# EAGLE board Okapi (EAGLE 9.6.2), part 1 of 2
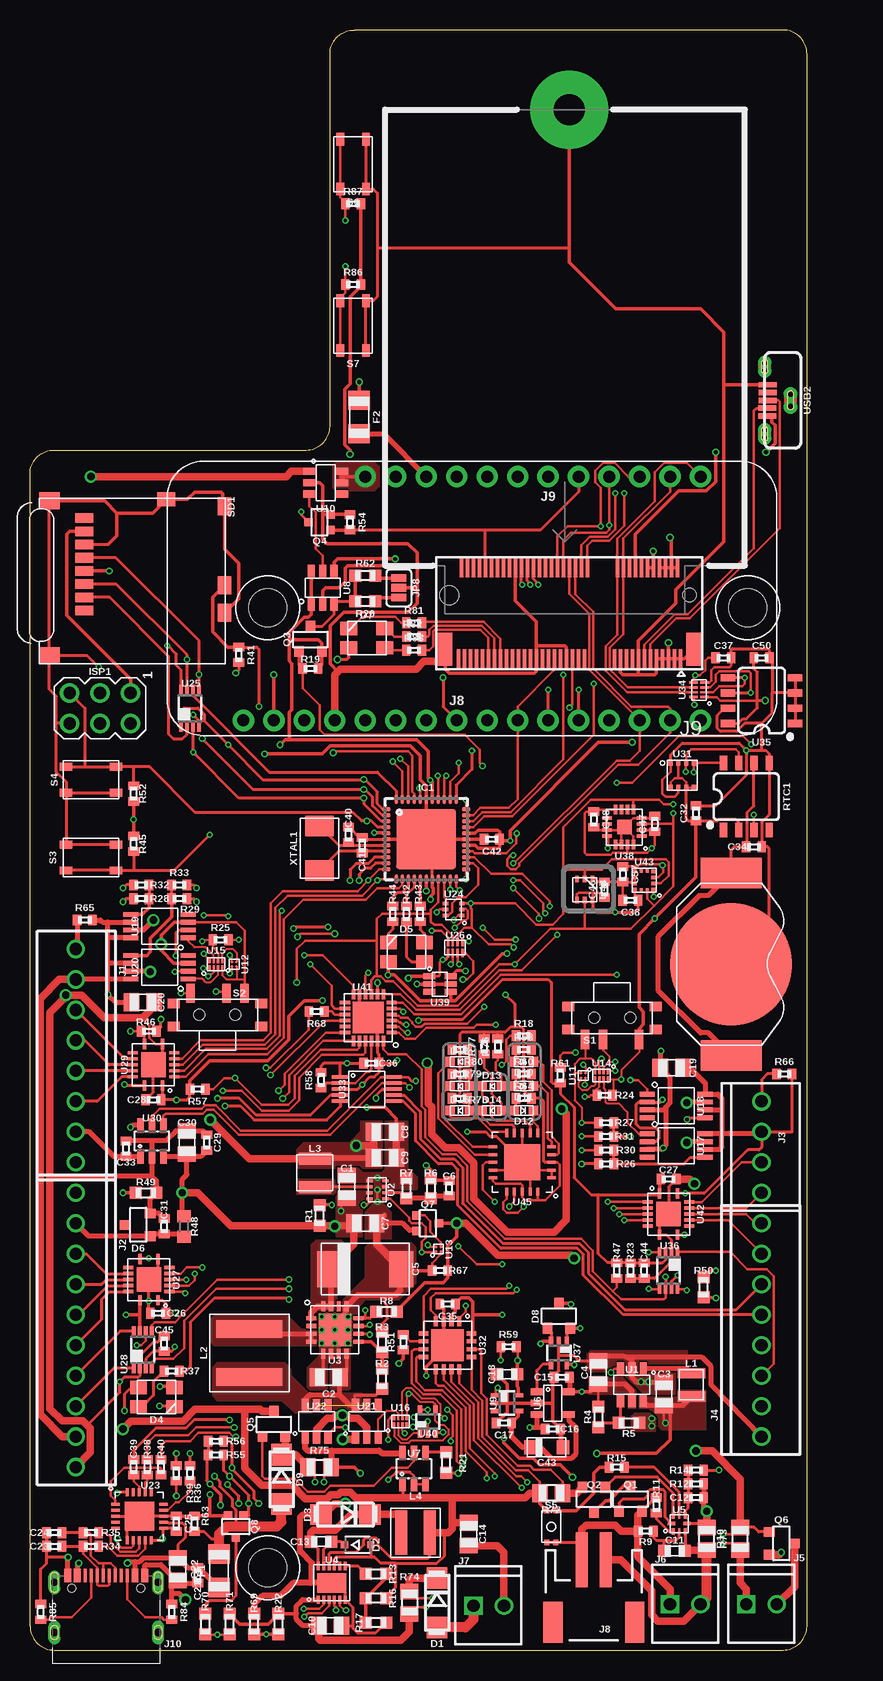
[diagram p6: board, top side]
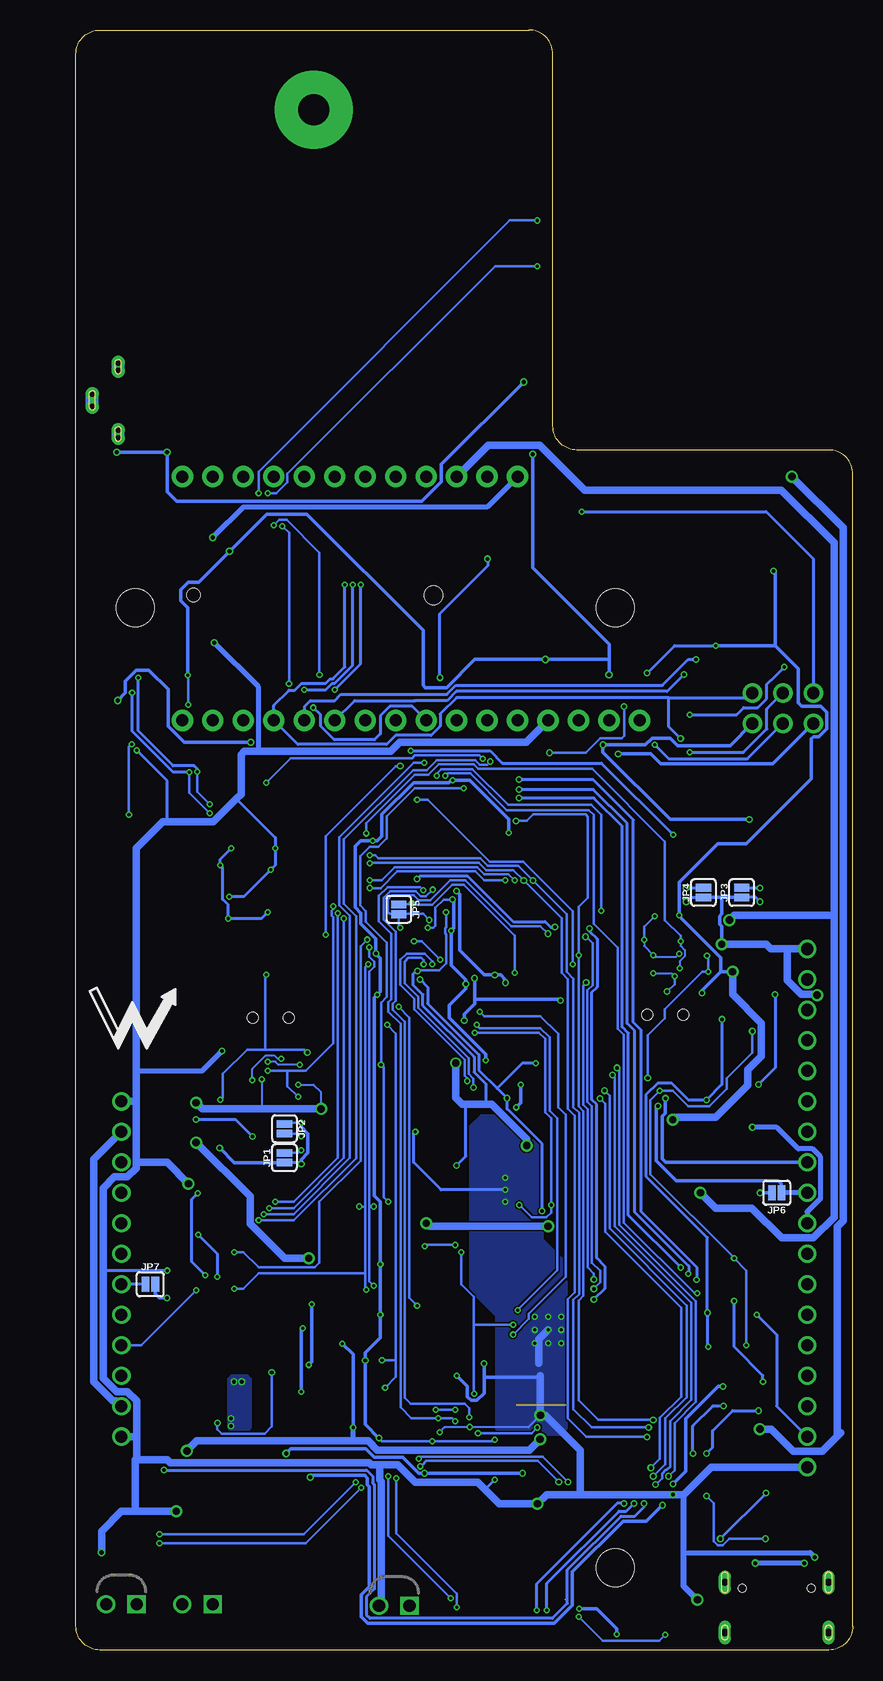
[diagram p7: board, bottom side, seen from below]

Size 64.75 x 135 mm. Coordinates in mm from the lower left corner, seen from the top.
Outline: 0,2 0,98 arc-90 2,100 23,100 arc90 25,102 25,133 arc-90 27,135 62.75,135 arc-90 64.75,133 64.75,2 arc-90 62.75,0 2,0 arc-90 0,2
Copper layers (1*16): Top 0.035559375mm / dielectric 1.6mm / Bottom 0.035559375mm
Design rules "jlcpcb-2layer": minimum track width 5mil, minimum drill 0.2mm, track to track 5mil, track to pad 6mil, pad to pad 5mil, via to via 6mil, smd to smd 5mil, copper to edge 15mil, drill to drill 6mil, minimum pad ring 5mil, minimum via ring 5mil, stop-mask expansion 2.5mil, vias tented up to drill 0mil, thermal gap 10mil
bRestrict: area 22.5,64 to 30.1,69.3; area 15.1,20.6 to 22.5,28.8

## Footprints (pad centres in the part's own frame; a part is rotated, then mirrored left to right if it is on the bottom)
LINX_BAT-HLD-012-SMT = smd 10.16 x 10.16: GND 0,0 | smd 2.54 x 5.08: POWER0 -7.62,0; POWER1 7.62,0
C0805 = smd 1.3 x 1.5: 1 -0.95,0; 2 0.95,0
C2917 = smd 2 x 3: + -3,0; - 3,0
C0402 = smd 0.7 x 0.9: 1 -0.65,0; 2 0.65,0
C0603 = smd 1 x 1: 1 -0.85,0; 2 0.85,0
C1206_TANT = smd 1.06 x 1.19: + -1.355,0; - 1.355,0
DO214AC = smd 1.8 x 1.7: A 2.05,0; C -2.05,0
SOD323-R = smd 0.6 x 0.6: A 1.1,0; C -1.1,0
CLVBA-FKA = smd 1.4 x 1.1: 1 -1.5,0.8; 2 -1.5,-0.8; 3 1.5,-0.8; 4 1.5,0.8
SOT23-3 = smd 0.8 x 0.9: 1 -0.95,-1; 2 0.95,-1; 3 0,1.1
SOT23-3@1 = smd 0.8 x 0.9: 1 -0.95,-1; 2 0.95,-1; 3 0,1.1
LED_0603 = smd 0.8 x 0.8: ANODE 0.8,0; CATHODE -0.8,0
1206 = smd 1.6 x 1.8: 1 -1.4,0; 2 1.4,0
4_40 = hole 3.175: 0,0
MLF44-TH = smd 0.7 x 0.3: 1 -3.325,2.5; 2 -3.325,2; 3 -3.325,1.5; 4 -3.325,1; 5 -3.325,0.5; 6 -3.325,0; 7 -3.325,-0.5; 8 -3.325,-1; 9 -3.325,-1.5; 10 -3.325,-2; 11 -3.325,-2.5; 23 3.325,-2.5; 24 3.325,-2; 25 3.325,-1.5; 26 3.325,-1; 27 3.325,-0.5; 28 3.325,0; 29 3.325,0.5; 30 3.325,1; 31 3.325,1.5; 32 3.325,2; 33 3.325,2.5 | smd 0.3 x 0.7: 12 -2.5,-3.325; 13 -2,-3.325; 14 -1.5,-3.325; 15 -1,-3.325; 16 -0.5,-3.325; 17 0,-3.325; 18 0.5,-3.325; 19 1,-3.325; 20 1.5,-3.325; 21 2,-3.325; 22 2.5,-3.325; 34 2.5,3.325; 35 2,3.325; 36 1.5,3.325; 37 1,3.325; 38 0.5,3.325; 39 0,3.325; 40 -0.5,3.325; 41 -1,3.325; 42 -1.5,3.325; 43 -2,3.325; 44 -2.5,3.325 | smd 5 x 5: TH 0,0
AVRISP = drill 1.02 pad 1.626: 1 -1.27,2.54; 2 1.27,2.54; 3 -1.27,0; 4 1.27,0; 5 -1.27,-2.54; 6 1.27,-2.54
1X08_SCREW = drill 1.016: 1 -8.89,0; 2 -6.35,0; 3 -3.81,0; 4 -1.27,0; 5 1.27,0; 6 3.81,0; 7 6.35,0; 8 8.89,0
1X10_SCREW = drill 1.016: 1 -11.43,0; 2 -8.89,0; 3 -6.35,0; 4 -3.81,0; 5 -1.27,0; 6 1.27,0; 7 3.81,0; 8 6.35,0; 9 8.89,0; 10 11.43,0
1X04_SCREW = drill 1.016: 1 -3.81,0; 2 -1.27,0; 3 1.27,0; 4 3.81,0
1X02_2.54_SCREWTERM = drill 1.016: P1 1.27,0 | drill 1.016 square: P2 -1.27,0
JST-2-SMD = smd 1 x 4.6: 1 -1,-3.7; 2 1,-3.7 | smd 1.6 x 3.4: NC1 -3.4,1.5; NC2 3.4,1.5
PARTICLE_M.2EKEY_NOPROG = smd 0.3 x 1.55: 1 -9.62,3.735; 2 -9.37,-3.815; 3 -9.12,3.735; 4 -8.87,-3.815; 5 -8.62,3.735; 6 -8.37,-3.815; 7 -8.12,3.735; 8 -7.87,-3.815; 9 -7.62,3.735; 10 -7.37,-3.815; 11 -7.12,3.735; 12 -6.87,-3.815; 13 -6.62,3.735; 14 -6.37,-3.815; 15 -6.12,3.735; 16 -5.87,-3.815; 17 -5.62,3.735; 18 -5.37,-3.815; 19 -5.12,3.735; 20 -4.87,-3.815; 21 -4.62,3.735; 22 -4.37,-3.815; 23 -4.12,3.735; 32 -1.87,-3.815; 33 -1.62,3.735; 34 -1.37,-3.815; 35 -1.12,3.735; 36 -0.87,-3.815; 37 -0.62,3.735; 38 -0.37,-3.815; 39 -0.12,3.735; 40 0.13,-3.815; 41 0.38,3.735; 42 0.63,-3.815; 43 0.88,3.735; 44 1.13,-3.815; 45 1.38,3.735; 46 1.63,-3.815; 47 1.88,3.735; 48 2.13,-3.815; 49 2.38,3.735; 50 2.63,-3.815; 51 2.88,3.735; 52 3.13,-3.815; 53 3.38,3.735; 54 3.63,-3.815; 55 3.88,3.735; 56 4.13,-3.815; 57 4.38,3.735; 58 4.63,-3.815; 59 4.88,3.735; 60 5.13,-3.815; 61 5.38,3.735; 62 5.63,-3.815; 63 5.88,3.735; 64 6.13,-3.815; 65 6.38,3.735; 66 6.63,-3.815; 67 6.88,3.735; 68 7.13,-3.815; 69 7.38,3.735; 70 7.63,-3.815; 71 7.88,3.735; 72 8.13,-3.815; 73 8.38,3.735; 74 8.63,-3.815; 75 8.88,3.735 | smd 1.2 x 2.75: 76 9.98,2.96; 77 -10.72,2.96 | drill 2.6 pad 6.5: GND -0.351,-42 | hole 1.1: -10.37,-1.54 | hole 1.55: 9.63,-1.54
USB_C_CUSB31-CFM2AX-01-X = smd 0.575 x 1.15: A1B12 -3.2,7.355; A4B9 -2.4,7.355; B1A12 3.2,7.355; B4A9 2.4,7.355 | smd 0.275 x 1.15: A5 -1.25,7.355; A6 -0.25,7.355; A7 0.25,7.355; A8 1.25,7.355; B5 1.75,7.355; B6 0.75,7.355; B7 -0.75,7.355; B8 -1.75,7.355 | drill 0.6 pad 1 long: M1 -4.32,6.78; M2 4.32,6.78; M3 -4.32,2.6; M4 4.32,2.6 | hole 0.65: 2.89,6.28; -2.89,6.28
SMT-JUMPER_2_NO_SILK = smd 0.635 x 1.27: 1 -0.406,0; 2 0.406,0
SMT-JUMPER_3_1-NC_PASTE_SILK = smd 0.635 x 1.27: 1 -0.813,0; 2 0,0; 3 0.813,0
1008 = smd 0.85 x 2.3: 1 -0.975,0; 2 0.975,0
WE-XHMI(6.65X6.45) = smd 1.45 x 5.5: 1 -2,0; 2 2,0
WE-LQS(3X3) = smd 1 x 2.7: P$1 -1.2,0; P$2 1.2,0
WE-MAIA(4.1X4.1) = smd 0.98 x 3.7: P$1 -1.185,0; P$2 1.185,0
FEATHERWING_MIN = drill 1 pad 1.778: 1 6.35,1.27; 2 8.89,1.27; 3 11.43,1.27; 4 13.97,1.27; 5 16.51,1.27; 6 19.05,1.27; 7 21.59,1.27; 8 24.13,1.27; 9 26.67,1.27; 10 29.21,1.27; 11 31.75,1.27; 12 34.29,1.27; 13 36.83,1.27; 14 39.37,1.27; 15 41.91,1.27; 16 44.45,1.27; 17 44.45,21.59; 18 41.91,21.59; 19 39.37,21.59; 20 36.83,21.59; 21 34.29,21.59; 22 31.75,21.59; 23 29.21,21.59; 24 26.67,21.59; 25 24.13,21.59; 26 21.59,21.59; 27 19.05,21.59; 28 16.51,21.59
SOT323 = smd 0.7 x 0.7: 1 -0.65,-0.925; 2 0.65,-0.925; 3 0,0.925
R0603 = smd 1 x 1: 1 -0.85,0; 2 0.85,0
R0402 = smd 0.7 x 0.9: 1 -0.65,0; 2 0.65,0
R0805 = smd 1.3 x 1.5: 1 -0.95,0; 2 0.95,0
R0603' = smd 1 x 1.1: 1 -0.85,0; 2 0.85,0
SO08 = smd 0.6 x 1.2: 1 -1.905,-2.8; 2 -0.635,-2.8; 3 0.635,-2.8; 4 1.905,-2.8; 5 1.905,2.8; 6 0.635,2.8; 7 -0.635,2.8; 8 -1.905,2.8
PCM12 = smd 0.7 x 1.6: 1 -2.25,1.8; 2 0.75,1.8; 3 2.25,1.8 | smd 1 x 0.8: BODY@1 -3.65,0.965; BODY@2 -3.65,-0.965; BODY@3 3.65,-0.965; BODY@4 3.65,0.965 | hole 0.9: -1.5,0; 1.5,0
SWITCH_4.2X3.2 = smd 1.05 x 0.65: 1 -2.075,1.075; 2 2.075,1.075; 3 -2.075,-1.075; 4 2.075,-1.075
SWITCH_2.6X1.6 = smd 0.45 x 0.45: A -1.325,0.375; A' -1.325,-0.375; B 1.325,0.375; B' 1.325,-0.375
MICROSD_CD = smd 0.8 x 1.5: 1 4.45,-3.75; 2 5.55,-3.75; 3 6.65,-3.75; 4 7.75,-3.75; 5 8.85,-3.75; 6 9.95,-3.75; 7 11.05,-3.75; 8 12.15,-3.75 | smd 1.5 x 1.15: CD1 6.55,-15.45; MT3 4.25,-15.45; MT4 13.15,-15.45 | smd 1.15 x 1.5: CD2 13.725,-10.6 | smd 1.4 x 1.7: MT1 13.6,-0.85; MT2 0.7,-0.85
DBV_R-PDSO-G6 = smd 0.6 x 1.05: 1 -0.95,-1.35; 2 0,-1.35; 3 0.95,-1.35; 4 0.95,1.35; 5 0,1.35; 6 -0.95,1.35
DLC_8 = smd 0.25 x 0.55: 1 -0.75,-0.675; 2 -0.25,-0.675; 3 0.25,-0.675; 4 0.75,-0.675; 5 0.75,0.675; 6 0.25,0.675; 7 -0.25,0.675; 8 -0.75,0.675
RSA_S-PVQFN-N16 = smd 0.35 x 0.85: 1 -0.975,-1.975; 2 -0.325,-1.975; 3 0.325,-1.975; 4 0.975,-1.975; 9 0.975,1.975; 10 0.325,1.975; 11 -0.325,1.975; 12 -0.975,1.975 | smd 0.85 x 0.35: 5 1.975,-0.975; 6 1.975,-0.325; 7 1.975,0.325; 8 1.975,0.975; 13 -1.975,0.975; 14 -1.975,0.325; 15 -1.975,-0.325; 16 -1.975,-0.975 | smd 2.7 x 2.7: PAD 0,0 | drill 0.254 pad 0.305: PAD@1 -1.1,1.1; PAD@2 0,1.1; PAD@3 1.1,1.1; PAD@4 -1.1,0; PAD@5 0,0; PAD@6 1.1,0; PAD@7 -1.1,-1.1; PAD@8 0,-1.1; PAD@9 1.1,-1.1
DFN_12_3X3 = smd 0.25 x 0.7: 1 -1.125,-1.4; 2 -0.675,-1.4; 3 -0.225,-1.4; 4 0.225,-1.4; 5 0.675,-1.4; 6 1.125,-1.4; 7 1.125,1.4; 8 0.675,1.4; 9 0.225,1.4; 10 -0.225,1.4; 11 -0.675,1.4; 12 -1.125,1.4 | smd 2.38 x 1.65: EP 0,0
RUG_S-PQFP-N8 = smd 0.55 x 0.25: 1 -0.675,0.5; 3 -0.675,-0.5; 5 0.675,-0.5; 7 0.675,0.5 | smd 0.55 x 0.2: 2 -0.675,0; 6 0.675,0 | smd 0.3 x 0.6: 4 0,-0.65; 8 0,0.65
SOT23-5 = smd 0.55 x 1: 1 -0.95,-1.35; 2 0,-1.35; 3 0.95,-1.35; 4 0.95,1.35; 5 -0.95,1.35
SOT23-6L = smd 0.55 x 1.2: 1 -0.95,-1.3; 2 0,-1.3; 3 0.95,-1.3; 4 0.95,1.3; 5 0,1.3; 6 -0.95,1.3
DDC_R-PDSO-G6 = smd 0.6 x 1.1: 1 -0.95,-1.35; 2 0,-1.35; 3 0.95,-1.35; 4 0.95,1.35; 5 0,1.35; 6 -0.95,1.35
DCK_R-PDSO-G5 = smd 0.35 x 0.8: 1 -0.65,-0.95; 2 0,-0.95; 3 0.65,-0.95; 4 0.65,0.95; 5 -0.65,0.95
DSBGD_4 = smd 0.23 x 0.23: A1 -0.2,0.2; A2 0.2,0.2; B1 -0.2,-0.2; B2 0.2,-0.2
DQE_R-PX2SON-N8 = smd 0.19 x 0.51: 1 -0.525,-0.335; 2 -0.175,-0.335; 3 0.175,-0.335; 4 0.525,-0.335; 5 0.525,0.335; 6 0.175,0.335; 7 -0.175,0.335; 8 -0.525,0.335
MSOP_8 = smd 1.26 x 0.4: 1 -2.4,0.975; 2 -2.4,0.325; 3 -2.4,-0.325; 4 -2.4,-0.975; 5 2.4,-0.975; 6 2.4,-0.325; 7 2.4,0.325; 8 2.4,0.975
QFN20 = smd 0.7 x 0.25: 1 -2.032,0.968; 2 -2.032,0.468; 3 -2.032,-0.032; 4 -2.032,-0.532; 5 -2.032,-1.032; 11 1.968,-1.032; 12 1.968,-0.532; 13 1.968,-0.032; 14 1.968,0.468; 15 1.968,0.968 | smd 0.25 x 0.7: 6 -1.032,-2.032; 7 -0.532,-2.032; 8 -0.032,-2.032; 9 0.468,-2.032; 10 0.968,-2.032; 16 0.968,1.968; 17 0.468,1.968; 18 -0.032,1.968; 19 -0.532,1.968; 20 -1.032,1.968 | smd 2.45 x 2.45: EP -0.032,-0.032
DRL_R-PDSO-N6 = smd 0.3 x 0.45: 1 -0.5,-0.675; 2 0,-0.675; 3 0.5,-0.675; 4 0.5,0.675; 5 0,0.675; 6 -0.5,0.675
DCU_(R-PDSO-G8) = smd 0.3 x 0.8: 1 -0.75,-1.55; 2 -0.25,-1.55; 3 0.25,-1.55; 4 0.75,-1.55; 5 0.75,1.55; 6 0.25,1.55; 7 -0.25,1.55; 8 -0.75,1.55
DQM_R-PX2SON-N8 = smd 0.2 x 0.7: 1 -0.6,-0.45; 2 -0.2,-0.45; 3 0.2,-0.45; 4 0.6,-0.45; 5 0.6,0.45; 6 0.2,0.45; 7 -0.2,0.45; 8 -0.6,0.45
RGY_S-PVQFN-N14 = smd 0.85 x 0.28: 1 -1.725,-0.75; 7 1.725,-0.75; 8 1.725,0.75; 14 -1.725,0.75 | smd 0.28 x 0.85: 2 -1,-1.725; 3 -0.5,-1.725; 4 0,-1.725; 5 0.5,-1.725; 6 1,-1.725; 9 1,1.725; 10 0.5,1.725; 11 0,1.725; 12 -0.5,1.725; 13 -1,1.725 | smd 2.05 x 2.05: EP 0,0
BME280 = smd 0.5 x 0.35: 1 1.025,0.975; 2 1.025,0.325; 3 1.025,-0.325; 4 1.025,-0.975; 5 -1.025,-0.975; 6 -1.025,-0.325; 7 -1.025,0.325; 8 -1.025,0.975
QFN16 = smd 0.8 x 0.35: 1 -2,0.975; 2 -2,0.325; 3 -2,-0.325; 4 -2,-0.975; 9 2,-0.975; 10 2,-0.325; 11 2,0.325; 12 2,0.975 | smd 0.35 x 0.8: 5 -0.975,-2; 6 -0.325,-2; 7 0.325,-2; 8 0.975,-2; 13 0.975,2; 14 0.325,2; 15 -0.325,2; 16 -0.975,2 | smd 2.7 x 2.7: EP 0,0
VSSOP_10 = smd 0.3 x 1.45: 1 -1,-2.2; 2 -0.5,-2.2; 3 0,-2.2; 4 0.5,-2.2; 5 1,-2.2; 6 1,2.2; 7 0.5,2.2; 8 0,2.2; 9 -0.5,2.2; 10 -1,2.2
QFN16_3X3 = smd 0.8 x 0.3: 1 -1.45,0.75; 2 -1.45,0.25; 3 -1.45,-0.25; 4 -1.45,-0.75; 9 1.45,-0.75; 10 1.45,-0.25; 11 1.45,0.25; 12 1.45,0.75 | smd 0.3 x 0.8: 5 -0.75,-1.45; 6 -0.25,-1.45; 7 0.25,-1.45; 8 0.75,-1.45; 13 0.75,1.45; 14 0.25,1.45; 15 -0.25,1.45; 16 -0.75,1.45 | smd 1.2 x 1.2: EP 0,0
SC-70_6 = smd 0.47 x 1: 1 -0.65,-0.9; 2 0,-0.9; 3 0.65,-0.9; 4 0.65,0.9; 5 0,0.9; 6 -0.65,0.9
QFN24 = smd 0.85 x 0.3: 1 -1.95,1.25; 2 -1.95,0.75; 3 -1.95,0.25; 4 -1.95,-0.25; 5 -1.95,-0.75; 6 -1.95,-1.25; 13 1.95,-1.25; 14 1.95,-0.75; 15 1.95,-0.25; 16 1.95,0.25; 17 1.95,0.75; 18 1.95,1.25 | smd 0.3 x 0.85: 7 -1.25,-1.95; 8 -0.75,-1.95; 9 -0.25,-1.95; 10 0.25,-1.95; 11 0.75,-1.95; 12 1.25,-1.95; 19 1.25,1.95; 20 0.75,1.95; 21 0.25,1.95; 22 -0.25,1.95; 23 -0.75,1.95; 24 -1.25,1.95 | smd 2.6 x 2.6: EP 0,0
LGA-12_2X2 = smd 0.3 x 0.35: 1 -0.75,-0.775; 2 -0.25,-0.775; 3 0.25,-0.775; 4 0.75,-0.775; 7 0.75,0.775; 8 0.25,0.775; 9 -0.25,0.775; 10 -0.75,0.775 | smd 0.3 x 0.25: 5 0.8,-0.25; 6 0.8,0.25; 11 -0.8,0.25; 12 -0.8,-0.25
VEML6030 = smd 0.55 x 0.3: 1 -0.875,0.65; 2 -0.875,0; 3 -0.875,-0.65; 4 0.875,-0.65; 5 0.875,0; 6 0.875,0.65
QFN20_5X5 = smd 0.7 x 0.25: 1 -2.45,1.3; 2 -2.45,0.65; 3 -2.45,0; 4 -2.45,-0.65; 5 -2.45,-1.3; 11 2.45,-1.3; 12 2.45,-0.65; 13 2.45,0; 14 2.45,0.65; 15 2.45,1.3 | smd 0.25 x 0.7: 6 -1.3,-2.45; 7 -0.65,-2.45; 8 0,-2.45; 9 0.65,-2.45; 10 1.3,-2.45; 16 1.3,2.45; 17 0.65,2.45; 18 0,2.45; 19 -0.65,2.45; 20 -1.3,2.45 | smd 3 x 3: EP 0,0
USB_MICRO_VERT_MOLEX = smd 0.45 x 1.5: 1 -1.3,0.78; 2 -0.65,0.78; 3 0,0.75; 4 0.65,0.75; 5 1.3,0.75 | drill 0.5 pad 1.1: P$1 -3.15,1; P$2 -2.45,1; P$3 2.45,1; P$4 3.15,1; P$5 -0.55,-1.15; P$6 0.55,-1.15
CRYSTAL_5X3.2_2-SMD = smd 1.7 x 2.4: OSC1 -1.85,0; OSC2 1.85,0

## Placement (x,y rotation side)
BT1  BATTERY_COIN12MM  [LINX_BAT-HLD-012-SMT]  58.42,57.15 90 top
C1  4.7uF  [C0805]  26.42,38.61 90 top
C2  22uF  [C0805]  24.89,22.73 180 top
C3  10uF  [C0805]  52.83,21.34 90 top
C4  10uF  [C0805]  47.37,23.11 90 top
C5  220uF  [C2917]  27.94,31.75 0 top
C6  68pF  [C0402]  34.92,38.48 270 top
C7  22uF  [C0805]  27.94,35.56 0 top
C8  22uF  [C0805]  29.59,43.18 0 top
C9  22uF  [C0805]  29.59,41.02 0 top
C10  22uF  [C0805]  25.02,2.03 0 top
C11  1uF  [C0603]  53.72,8.26 0 top
C12  0.1uF  [C0402]  55.5,12.7 0 top
C13  1uF  [C0603]  24.26,9.02 0 top
C14  10uF  [C0805]  36.58,9.65 270 top
C15  0.22uF  [C0402]  44.32,22.73 180 top
C16  0.22uF  [C0402]  43.56,18.41 0 top
C17  0.1uF  [C0402]  39.5,18.92 180 top
C18  4.7uF  [C0603]  39.75,22.99 180 top
C19  22uF  [C0805]  53.47,48.51 180 top
C20  22uF  [C0805]  9.4,53.98 0 top
C21  0.1uF  [C0402]  13.97,6.22 270 top
C22  10uF  [C0805]  12.32,6.73 270 top
C23  12pF  [C0402]  2.03,8.64 0 top
C24  12pF  [C0402]  2.03,9.78 0 top
C25  0.1uF  [C0402]  12.19,10.54 90 top
C26  0.1uF  [C0402]  10.67,28.07 180 top
C27  0.1uF  [C0402]  53.21,39.24 0 top
C28  0.1uF  [C0402]  10.29,45.85 180 top
C29  0.1uF  [C0402]  14.73,42.29 90 top
C30  10uF  [C0805]  13.08,42.29 90 top
C31  0.1uF  [C0402]  11.18,35.31 90 top
C32  0.1uF  [C0402]  55.5,69.72 90 top
C33  0.1uF  [C0402]  8,41.78 90 top
C34  0.1uF  [C0402]  60.33,66.93 0 top
C35  0.1uF  [C0402]  34.8,28.83 180 top
C36  0.1uF  [C0402]  28.45,48.9 0 top
C37  0.1uF  [C0402]  57.78,82.68 0 top
C38  0.1uF  [C0402]  50.04,62.48 180 top
C39  0.1uF  [C0402]  8.64,15.24 90 top
C40  12pF  [C0402]  26.54,67.94 270 top
C41  12pF  [C0402]  27.69,67.06 270 top
C42  1uF  [C0402]  38.48,67.56 180 top
C43  100uF  [C1206_TANT]  43.05,16.89 0 top
C44  0.1uF  [C0402]  51.18,31.62 270 top
C45  0.1uF  [C0402]  11.18,25.53 90 top
C46  0.1uF  [C0402]  47.88,63.37 90 top
C47  0.1uF  [C0402]  52.07,68.83 90 top
C48  0.1uF  [C0402]  46.99,69.22 270 top
C50  0.1uF  [C0402]  60.96,82.68 0 top
C57  0.1uF  [C0402]  49.4,64.64 270 top
D1  [DO214AC]  33.91,3.94 270 top
D2  [SOD323-R]  27.3,8.76 0 top
D3  [DO214AC]  26.29,11.3 180 top
D4  CLVBA-FKA  [CLVBA-FKA]  10.54,21.08 180 top
D5  CLVBA-FKA  [CLVBA-FKA]  31.37,58.17 0 top
D6  [SOT23-3]  9.02,35.43 90 top
D7  CLVBA-FKA  [CLVBA-FKA]  28.07,84.33 0 top
D8  BAT54C  [SOT23-3@1]  44.07,27.81 0 top
D9  [DO214AC]  20.95,14.22 270 top
D10  LEDGREEN0603  [LED_0603]  41.15,49.02 180 top
D11  LEDYELLOW0603  [LED_0603]  41.15,46.99 180 top
D12  LEDRED0603  [LED_0603]  41.15,44.96 180 top
D13  LEDGREEN0603  [LED_0603]  38.48,46.99 0 top
D14  LEDYELLOW0603  [LED_0603]  38.48,44.96 0 top
D16  LEDGREEN0603  [LED_0603]  35.81,44.96 0 top
D17  LEDYELLOW0603  [LED_0603]  35.81,46.99 0 top
D18  LEDRED0603  [LED_0603]  35.81,49.02 0 top
F1  [1206]  15.75,6.6 90 top
F2  [1206]  27.43,102.74 270 top
H1  [4_40]  59.81,86.86 0 top
H2  [4_40]  19.81,6.86 0 top
H3  [4_40]  19.81,86.86 0 top
IC1  ATMEGA1284M  [MLF44-TH]  33.02,67.56 0 top
ISP1  AVRISP-6  [AVRISP]  5.84,78.49 270 top
J1  CONN_82.54_SCREW  [1X08_SCREW]  3.81,49.53 270 top
J2  [1X10_SCREW]  3.81,26.67 270 top
J3  CONN_42.54_SCREW  [1X04_SCREW]  60.96,41.91 270 top
J4  CONN_82.54_SCREW  [1X08_SCREW]  60.96,26.67 90 top
J5  [1X02_2.54_SCREWTERM]  60.96,3.81 0 top
J6  [1X02_2.54_SCREWTERM]  54.61,3.81 0 top
J7  [1X02_2.54_SCREWTERM]  38.23,3.68 0 top
J8  [JST-2-SMD]  46.99,3.81 180 top
J9  B_SERIES_M.2EKEY_NOPROG  [PARTICLE_M.2EKEY_NOPROG]  44.58,86.36 180 top
J10  [USB_C_CUSB31-CFM2AX-01-X]  6.35,-1.14 0 top
JP1  JUMPER-SMT_2_NO_SILK  [SMT-JUMPER_2_NO_SILK]  47.37,41.02 90 bottom
JP2  JUMPER-SMT_2_NO_SILK  [SMT-JUMPER_2_NO_SILK]  47.37,43.43 270 bottom
JP3  JUMPER-SMT_2_NO_SILK  [SMT-JUMPER_2_NO_SILK]  9.27,63.12 90 bottom
JP4  JUMPER-SMT_2_NO_SILK  [SMT-JUMPER_2_NO_SILK]  12.45,63.12 90 bottom
JP5  JUMPER-SMT_2_NO_SILK  [SMT-JUMPER_2_NO_SILK]  37.85,61.72 270 bottom
JP6  JUMPER-SMT_2_NO_SILK  [SMT-JUMPER_2_NO_SILK]  6.35,38.1 180 bottom
JP7  JUMPER-SMT_2_NO_SILK  [SMT-JUMPER_2_NO_SILK]  58.55,30.48 0 bottom
JP8  JUMPER-SMT_3_1-NC_PASTE_SILK  [SMT-JUMPER_3_1-NC_PASTE_SILK]  30.73,88.52 270 top
L1  6.8uH  [1008]  55.12,22.1 90 top
L2  10uH  [WE-XHMI(6.65X6.45)]  18.29,24.77 90 top
L3  1uH  [WE-LQS(3X3)]  23.75,39.75 90 top
L4  4.7uH  [WE-MAIA(4.1X4.1)]  32.13,9.78 0 top
MS1  FEATHERWINGLAYOUT  [FEATHERWING_MIN]  11.43,76.2 0 top
Q1  DMG3404  [SOT23-3]  50.04,12.57 0 top
Q2  DMG3404  [SOT23-3]  46.99,12.57 180 top
Q3  FDN360P  [SOT23-3@1]  23.37,84.2 0 top
Q4  2N7002  [SOT323]  24.13,93.98 90 top
Q5  FDN360P  [SOT23-3@1]  20.32,18.8 0 top
Q6  DMG3404  [SOT23-3]  62.61,8.89 270 top
Q7  2N7002  [SOT323]  33.15,35.56 270 top
Q8  2N7002  [SOT323]  17.14,10.29 180 top
R1  180k  [R0603]  24.13,36.2 270 top
R2  1.62M  [R0603]  29.34,22.61 270 top
R3  360k  [R0603]  29.34,25.65 270 top
R4  1.62M  [R0603]  47.37,19.43 90 top
R5  180k  [R0603]  49.91,18.92 180 top
R6  820k  [R0603]  33.4,38.48 90 top
R7  180k  [R0603]  31.37,38.48 270 top
R8  180k  [R0603]  29.72,28.19 0 top
R9  330  [R0402]  51.31,9.91 180 top
R10  3m  [R0805]  56.39,9.27 90 top
R11  20  [R0402]  52.2,12.06 90 top
R12  1k  [R0402]  55.5,13.84 180 top
R13  182k  [R0603]  28.83,6.35 180 top
R14  100R  [R0402]  55.5,14.99 180 top
R15  2k  [R0402]  48.9,15.24 0 top
R16  91k  [R0603]  28.83,4.32 180 top
R17  330k  [R0603]  28.83,2.29 0 top
R18  100k  [R0402]  41.15,51.18 0 top
R19  120k  [R0402]  23.37,81.79 0 top
R20  130k  [R0603]  27.94,87.38 180 top
R21  470k  [R0603]  34.67,15.62 270 top
R22  143k  [R0603]  20.7,2.16 90 top
R23  100k  [R0402]  50.04,31.62 90 top
R24  10k  [R0402]  47.88,46.23 0 top
R25  10k  [R0402]  15.88,59.18 0 top
R26  287R  [R0402]  48.01,40.51 0 top
R27  287R  [R0402]  48.01,43.94 180 top
R28  287R  [R0402]  9.27,62.61 0 top
R29  287R  [R0402]  12.45,62.61 0 top
R30  287R  [R0402]  48.01,41.66 0 top
R31  287R  [R0402]  48.01,42.8 180 top
R32  287R  [R0402]  9.27,63.75 0 top
R33  287R  [R0402]  12.45,63.75 0 top
R34  27  [R0402]  5.08,8.64 180 top
R35  27  [R0402]  5.08,9.78 180 top
R36  330  [R0402]  12.19,14.73 270 top
R37  330  [R0402]  11.81,23.24 0 top
R38  330  [R0402]  9.78,15.24 270 top
R39  330  [R0402]  13.34,14.73 270 top
R40  330  [R0402]  10.92,15.24 270 top
R41  10k  [R0402]  17.4,82.93 270 top
R42  330  [R0402]  31.37,61.34 270 top
R43  330  [R0402]  32.51,61.34 270 top
R44  330  [R0402]  30.23,61.34 270 top
R45  10k  [R0402]  8.64,67.18 90 top
R46  10k  [R0402]  9.91,51.56 0 top
R47  10k  [R0402]  48.9,31.62 90 top
R48  330R  [R0603']  12.83,35.31 90 top
R49  10k  [R0603]  9.65,38.1 180 top
R50  10k  [R0603]  56.13,30.23 270 top
R51  [R0402]  31.11,25.65 90 top
R52  10k  [R0402]  8.64,71.37 270 top
R53  220R  [R0402]  41.15,50.04 0 top
R54  [R0402]  26.67,93.98 270 top
R55  1M  [R0402]  15.49,16.26 180 top
R56  1M  [R0402]  15.49,17.4 180 top
R57  100k  [R0402]  13.97,46.74 180 top
R58  100k  [R0402]  24.26,47.5 90 top
R59  1M  [R0402]  39.88,25.27 0 top
R60  220R  [R0402]  41.15,48.01 0 top
R61  100k  [R0402]  44.2,47.88 270 top
R62  330k  [R0603]  27.94,89.53 180 top
R63  100k  [R0402]  13.72,10.54 270 top
R64  220R  [R0402]  41.15,45.97 0 top
R65  180k  [R0402]  4.57,60.83 0 top
R66  180k  [R0402]  62.87,48.01 0 top
R67  10k  [R0402]  34.16,31.62 0 top
R68  1M  [R0402]  23.88,53.21 180 top
R69  100k  [R0603]  18.67,2.16 270 top
R70  200k  [R0603]  14.61,2.16 270 top
R71  1M  [R0603]  16.64,2.16 90 top
R72  [R0805]  43.43,13.08 180 top
R73  [R0805]  59.18,9.27 90 top
R74  [R0805]  31.62,3.94 270 top
R75  [R0805]  24.13,15.24 0 top
R76  220R  [R0402]  38.99,50.29 90 top
R77  220R  [R0402]  37.85,50.29 90 top
R78  220R  [R0402]  35.81,45.97 180 top
R79  220R  [R0402]  35.81,48.01 180 top
R80  220R  [R0402]  35.81,50.04 180 top
R81  5.6k  [R0402]  32,85.6 0 top
R82  5.6k  [R0402]  32,84.45 0 top
R83  5.6k  [R0402]  32,83.31 0 top
R84  [R0402]  11.81,3.17 270 top
R85  [R0402]  0.89,3.17 270 top
R86  [R0402]  26.92,113.79 0 top
R87  [R0402]  26.92,120.52 0 top
RTC1  DS3231M  [SO08]  59.69,71.12 0 top
S1  SPDTPCM12  [PCM12]  48.51,52.67 180 top
S2  SPDTPCM12  [PCM12]  15.62,52.92 0 top
S3  BUTTON4.2X3.2  [SWITCH_4.2X3.2]  5.08,66.04 0 top
S4  BUTTON4.2X3.2  [SWITCH_4.2X3.2]  5.08,72.52 180 top
S5  BUTTON2.6X1.6  [SWITCH_2.6X1.6]  43.43,10.29 90 top
S6  BUTTON4.2X3.2  [SWITCH_4.2X3.2]  26.92,123.83 90 top
S7  BUTTON4.2X3.2  [SWITCH_4.2X3.2]  26.92,110.36 90 top
SD1  MICROSDCD  [MICROSD_CD]  0.76,82.17 90 top
U1  TLV61220DBV  [DBV_R-PDSO-G6]  50.16,22.1 180 top
U2  TPS62822DLC  [DLC_8]  28.96,38.35 90 top
U3  TPS61032RSA  [RSA_S-PVQFN-N16]  25.4,26.67 270 top
U4  [DFN_12_3X3]  25.15,5.59 0 top
U5  BQ2980RUG  [RUG_S-PQFP-N8]  54.1,10.54 90 top
U6  TPS2105  [SOT23-5]  43.56,20.57 270 top
U7  LTC4412S6  [SOT23-6L]  32,15.11 0 top
U8  TPL5111DDC  [DDC_R-PDSO-G6]  24.38,88.52 0 top
U9  TPS79733  [DCK_R-PDSO-G5]  39.75,20.57 270 top
U10  TPS22917DBV  [DBV_R-PDSO-G6]  24.64,97.28 270 top
U11  SN74AUP1G04YFP  [DSBGD_4]  46.1,47.88 270 top
U12  SN74AUP1G04YFP  [DSBGD_4]  17.02,57.15 90 top
U13  SN74AUP1G04YFP  [DSBGD_4]  34.04,33.4 90 top
U14  SN74AUP2G08DQE  [DQE_R-PX2SON-N8]  47.62,47.88 180 top
U15  SN74AUP2G08DQE  [DQE_R-PX2SON-N8]  15.49,57.15 0 top
U16  SN74AUP2G08DQE  [DQE_R-PX2SON-N8]  30.86,19.05 0 top
U17  MIC2544MSOP  [MSOP_8]  53.85,42.04 0 top
U18  MIC2544MSOP  [MSOP_8]  53.85,45.34 0 top
U19  MIC2544MSOP  [MSOP_8]  10.79,60.33 180 top
U20  MIC2544MSOP  [MSOP_8]  10.79,56.9 180 top
U21  TPS22917DBV  [DBV_R-PDSO-G6]  28.07,19.05 0 top
U22  TPS22917DBV  [DBV_R-PDSO-G6]  23.88,19.05 0 top
U23  FT231X-Q  [QFN20]  9.14,11.18 0 top
U24  SN74LVC1G3157DRL  [DRL_R-PDSO-N6]  35.31,61.72 90 top
U25  SN74AUP3G34DCU  [DCU_(R-PDSO-G8)]  13.34,78.49 0 top
U26  TXS0102DQM  [DQM_R-PX2SON-N8]  35.43,58.55 180 top
U27  TXS0104RGY  [RGY_S-PVQFN-N14]  9.91,30.86 90 top
U28  TCA9406DCU  [DCU_(R-PDSO-G8)]  9.4,25.02 0 top
U29  TXS0104RGY  [RGY_S-PVQFN-N14]  10.29,48.77 90 top
U30  MCP4726A2SOT-23  [SOT23-6L]  10.16,42.42 0 top
U31  BME280  [BME280]  54.36,72.9 90 top
U32  PAC1934QFN  [QFN16]  34.8,25.4 270 top
U33  ADS1115  [VSSOP_10]  28.07,46.74 270 top
U34  TXS0102DQM  [DQM_R-PX2SON-N8]  55.75,80.01 90 top
U35  MB85RC  [SO08]  60.96,79.12 90 top
U36  TCA9406DCU  [DCU_(R-PDSO-G8)]  53.21,31.62 180 top
U37  TLV3691DCK  [DCK_R-PDSO-G5]  44.07,24.77 180 top
U38  MLX90393  [QFN16_3X3]  49.53,68.58 180 top
U39  MIC94094C6  [SC-70_6]  34.16,55.5 270 top
U40  SN74AHC1G86DCK  [DCK_R-PDSO-G5]  33.15,19.05 0 top
U41  MCP23018QFN  [QFN24]  28.19,52.7 180 top
U42  TXS0104RGY  [RGY_S-PVQFN-N14]  53.21,36.32 270 top
U43  BMA456  [LGA-12_2X2]  51.18,64.14 90 top
U44  VEML6030  [VEML6030]  46.23,63.37 270 top
U45  PCA9634QFN  [QFN20_5X5]  41.02,40.64 180 top
U$1  VDIV-JP  [VDIV_GENERIC]  8.26,36.45 0 top
U$2  VDIV-JP  [VDIV_GENERIC]  55.12,28.83 0 top
U$4  [NWLOGO_MED]  60.07,53.09 0 bottom
USB2  USB_MICROVERT  [USB_MICRO_VERT_MOLEX]  62.23,104.14 90 top
XTAL1  CRYSTAL8MHZ5X3.2  [CRYSTAL_5X3.2_2-SMD]  24.13,66.8 90 top

## Tracks (layer width: path | path; a pad name or v marks a point on that pad's centre or on a via)
3V3_AUX  (via drill 0.25, 0.3, 0.3 pad 0.4, 0.6, 0.6 pad 1)
  Top 0.152: U12.A2 16.82,57.73 v16.64,57.91 | R25.2 v17.4,59.18 | U14.8 48.64,47.54 | 48.64,47.54 v49.27,47.54 49.27,48.31 50.76,49.8 S1.1 | v46.23,47.12 46.3,47.19 U11.A2 | R24.2 48.64,46.34 48.64,47.54 | v14.48,58.01 14.48,57.98 U15.8
  Top 0.2: v12.57,54.74 13.36,54.74 S2.1 13.37,54.01 | U31.8 53.38,72.3 53.72,72.64 53.98,72.64 | U31.5 U31.6 54.68,72.32 54.36,72.64 53.98,72.64 | U31.2 54.03,72.7 53.98,72.64 | U24.5 34.16,61.72 v33.91,61.47 | v14.47,61.21 16.45,61.21 v16.51,61.16 | C57.1 50.42,65.29 | 50.42,65.29 50.66,65.29 50.83,65.46 52.63,65.46 v52.71,65.39 52.79,65.3 52.79,64.81 52.37,64.39 U43.3 | U43.7 50.41,65.28 50.42,65.29 | C38.1 50.69,62.61 50.41,62.89 U43.10 | U44.4 45.58,62.98 45.72,63.12 46.86,63.12 | 46.86,63.12 47.36,63.12 47.75,62.72 C46.1 | U44.6 46.88,63.1 46.86,63.12 | U38.2 51.92,68.33 C47.1 52.07,67.06 v51.82,66.8 51.44,66.42 49.78,66.42 | U38.8 47.16,70.03 C48.1 46.37,69.86 46.23,69.72 46.23,66.42 46.38,66.27 48.41,66.27 48.56,66.42 49.78,66.42 | U38.15 49.78,66.42
  Top 0.254: RTC1.2 59.05,68.98 58.84,69.2 57.37,69.2 57.24,69.07 C32.1 54.86,69.07 54.68,69.26 U31.6 | U25.8 12.59,81.65 12.19,82.04 12.19,83 11.5,83.69 v11.43,83.69 | v36.28,56.59 35.5,56.59 U39.6 | R41.2 17.4,81.66 v17.14,81.41 | U44.6 46.88,61.83 47.24,61.47 v48.77,61.47 50.42,61.47 50.69,61.74 C38.1
  Top 0.305: C32.1 55.5,64.39 v52.07,60.96 50.76,59.65 50.76,53.56 51.12,53.2 51.12,52.13 50.76,51.77 S1.1 | v6.59,89.93 v6.6,89.92 SD1.4 | C6.1 33.6,39.13 R6.2 33.4,40.01 v33.02,40.39
  Top 0.406: v10.03,56.52 9.98,56.57 U20.7 | U18.7 54.81,45.66 v54.74,45.59
  Top 0.508: L3.P$2 23.75,41.02 C9.1
  Top 0.61: L3.P$2 18.27,40.95 v15.02,44.2 | C9.1 28.64,42.16 | 28.64,42.16 C8.1 | v27.18,42.04 28.51,42.04 28.64,42.16 | v44.32,45.09 44.7,44.7 44.7,35.84 43.69,34.82 39.79,34.82 37,37.61 37,40.59 35.73,41.86 34.59,41.86 33.47,42.97 33.47,45.26 33.19,45.54 33.19,48.62 33.1,48.72 v33.1,48.92
  Bottom 0.152: v17.4,59.18 17.4,58.67 v16.64,57.91 16.48,57.76 14.73,57.76 v14.48,58.01 | v46.23,47.12 44.96,47.12 44.32,46.48 v44.32,45.09 | v49.27,47.54 49.27,45.09
  Bottom 0.2: v17.4,59.18 17.4,60.27 v16.51,61.16 | v36.28,56.59 36.22,56.64 34.46,56.64 33.88,57.22 33.88,59.61 33.98,59.71 33.98,60.13 33.88,60.23 33.88,61.44 v33.91,61.47
  Bottom 0.254: v11.43,83.69 14.86,83.69 v17.14,81.41 | 11.02,45.06 10.77,45.06 | v36.28,56.59 36.4,56.59 36.62,56.36 36.62,55.4 35.84,54.61 35.84,53.69 31.57,49.43 31.57,48.16 30.61,47.19 30.61,45.47 | v33.02,40.39 32.26,41.15 32.26,45.47 | v48.77,61.47 49.28,60.96 v52.07,60.96 52.07,62.11 52.52,62.56 52.52,65.2 v52.71,65.39 52.71,65.91 v51.82,66.8
  Bottom 0.305: v10.03,56.52 11.02,56.52 | 11.02,56.52 11.02,57.7 14.47,61.16 v14.47,61.21 14.47,63.96 11.25,67.18 8.89,67.18 3.45,72.62 3.45,75.92 3.28,76.1 2.84,76.1 2.18,76.75 2.18,78.13 2.69,78.64 4.27,78.64 4.57,78.94 4.57,81.79 6.48,83.69 | 11.02,56.52 12.57,54.96 v12.57,54.74 | 6.48,83.69 v11.43,83.69 | 6.48,83.69 6.48,89.79 v6.6,89.92
  Bottom 0.61: v10.03,56.52 10.03,54.63 7.65,52.25 7.65,49.48 8.76,48.37 8.76,47.07 10.77,45.06 11.43,44.4 14.82,44.4 v15.02,44.2 | v44.32,45.09 49.27,45.09 54.23,45.09 v54.74,45.59 | v27.18,42.04 27.18,42.55 30.1,45.47 30.61,45.47 32.26,45.47 32.53,45.47 33.1,46.03 v33.1,48.92
  pour Top (rank 3, no thermals): 29.59,44.07 29.59,40.13 22.23,40.13 22.23,41.66 22.86,42.29 26.67,42.29 27.56,43.18 27.56,44.07
3V3_AUX_PG  (via drill 0.25, 0.25 pad 0.4)
  Top 0.2: v31.5,51.44 31.25,51.44 30.74,51.94 30.16,51.94 U41.2
  Top 0.254: U2.8 28.28,37.3 28.07,37.08 v27.81,37.08 | v25.15,37.08 24.17,37.08 R1.1
  Bottom 0.2: v27.81,37.08 26.78,36.05 25.55,36.05 25.15,36.45 v25.15,37.08 25.15,44.31 25.65,44.82 25.65,50.93 26.16,51.44 v31.5,51.44
3V3_CORE  (via drill 0.25, 0.3, 0.35)
  Top 0.2: U16.8 30.08,19.39 29.84,19.15 v29.84,17.53 | v40.64,24.13 40.64,25.16 R59.2 | U40.5 32.52,20.03 v33.15,20.03 | v35.05,17.4 35.05,17.65 35.23,17.82 35.23,19.55 v34.76,20.03 | U13.A2 33.3,33.6 v33.15,33.75 | v39.37,32.13 37.21,32.13 v35.69,33.66 | U45.15 38.57,39.09 38.8,38.86 40.89,38.86 41.02,38.73 U45.18 41.02,37.72 41.27,37.46 42.29,37.46 | 42.29,37.46 42.93,37.46 44.15,38.68 44.15,40.44 43.94,40.64 43.31,40.64 | U45.20 42.32,37.49 42.29,37.46 | U34.1 57.24,79.41 57.53,79.12 60.6,79.12
  Top 0.254: R56.2 R55.2 14.72,16.13 14.72,14.11 v14.99,13.84 | v28.96,55.6 28.94,55.59 U41.8 | 41.15,48.01 41.15,46.59 41.43,46.31 41.46,46.31 R64.2 42.55,45.97 42.8,45.72 42.8,42.26 42.8,40.77 42.93,40.64 43.31,40.64 U45.3 | 41.15,48.01 41.15,49.53 | 41.15,49.53 41.15,50.04 R53.2 | 41.15,49.53 41.13,49.55 41.13,51.18 | 40.39,51.91 40.96,51.91 41.13,51.75 41.13,51.18 | 40.39,51.91 40.03,51.91 39.59,51.47 38.99,51.47 | 38.99,51.47 37.85,51.47 | 37.85,51.47 35.97,51.47 35.81,51.31 35.81,50.04 | R78.2 35.43,45.97 35.81,46.35 35.81,48.01 | 35.81,50.04 35.81,48.01 | R79.2 35.81,48.01 | R80.2 35.81,50.04 | R60.2 41.15,48.01 | R18.2 41.13,51.18 | R77.2 37.85,51.47 | R76.2 38.99,51.47 | v39.62,54.61 40.39,53.85 40.39,51.91 | U35.8 59.02,77.22 59.41,77.6 59.69,77.6 60.6,78.51 60.6,79.12 | C50.1 60.31,81.79 60.6,81.49 60.6,79.12 | v61.27,79.12 60.6,79.12
  Top 0.305: U9.5 40.7,21.86 40.6,21.96 C18.1 40.6,24.09 v40.64,24.13 | v39.5,17.65 39.5,17.27 40.78,15.99 41.92,15.99 42.48,15.43 44.18,15.43 v45.21,14.4 | v15.88,12.06 15.88,12.95 v14.99,13.84 | D4.2 12.13,21.97 v10.83,21.97 | D5.2 29.87,56.28 v29.84,56.26 30.35,56.26 32.51,54.1 35.05,54.1 | v33.02,63.25 IC1.17 | IC1.5 29.66,68.1 v28.68,68.1 | IC1.38 33.52,72.31 v33.36,72.47 33.2,72.63 33.2,74.9 32.23,75.86 21.59,75.86 | IC1.29 37.08,68.06 37.34,68.33 38.99,68.33 39.13,68.18 C42.1 | IC1.27 37.1,67.06 37.35,66.81 39,66.81 39.13,66.94 C42.1 | 21.59,75.86 21.25,75.86 v20.83,75.44 | U8.6 U8.1 23.43,86.3 23.19,86.06 22.84,86.06 21.59,84.8 21.59,84.2 | R19.2 24.32,82.09 Q3.2 24.32,83.89 24,84.2 21.59,84.2 | R45.2 v8.64,69.22 R52.2 | 35.05,54.1 35.44,54.1 39.37,58.04 v39.75,58.04 | U39.4 35.06,54.12 35.05,54.1 | 36.88,27.94 36.88,29.03 36.58,29.34 35.96,29.34 C35.1 35.45,28.21 35.12,27.88 U32.2 | 36.88,27.94 36.88,26.46 U32.16 U32.15 | 36.88,27.94 v39.37,27.94 | 21.59,84.2 21.59,82.42 21.82,82.2 21.82,78.37 21.59,78.14 21.59,75.86 | v50.19,75.64 47.37,75.64 40.01,68.28 v40.01,67.44 39.26,67.44 C42.1
  Bottom 0.2: v29.84,17.53 29.91,17.53 30.04,17.4 v35.05,17.4 39.24,17.4 v39.5,17.65 | v33.15,20.03 v34.76,20.03 | v35.69,33.66 35.59,33.75 v33.15,33.75
  Bottom 0.305: v15.88,12.06 17.21,10.73 19.14,10.73 23.37,6.5 23.37,3.71 24.87,2.21 40.41,2.21 40.97,2.77 40.97,4.6 40.3,5.27 40.3,13.61 40.45,13.77 40.45,14.32 40.69,14.55 45.06,14.55 v45.21,14.4 | v14.99,13.84 13.92,14.91 13.92,19.27 11.21,21.97 v10.83,21.97 | v28.96,55.6 28.96,55.86 29.36,56.26 v29.84,56.26 30.73,56.26 32.77,58.29 32.77,62.99 v33.02,63.25 | v28.68,68.1 28.68,69.24 31.91,72.47 v33.36,72.47 33.49,72.47 33.69,72.26 36.62,72.26 39.24,69.64 39.24,67.82 39.62,67.44 v40.01,67.44 41.02,67.44 41.47,66.98 41.47,61.88 41,61.41 41,60.53 39.75,59.28 v39.75,58.04 39.37,57.66 39.37,54.86 v39.62,54.61 39.88,54.35 39.88,37.85 39.37,37.34 v39.37,32.13 v39.37,27.94 39.37,26.04 40.64,24.77 v40.64,24.13 40.64,18.8 v39.5,17.65 | ISP1.2 10.23,75.36 14.59,75.36 15.22,76 16.74,76 17.3,75.44 v20.83,75.44 20.83,74.8 15.24,69.22 v8.64,69.22 | v50.19,75.64 55.74,75.64 57.07,76.98 57.07,80.06 58.67,81.66 59.72,81.66 60.63,80.75 60.63,79.76 v61.27,79.12
3V3_CORE_ISO  (via drill 0.25, 0.3)
  Top 0.2: U26.5 34.83,57.72 34.64,57.53 v34.39,57.53 34.16,57.31 34.16,56.26 34.05,56.15 U39.1 | v36.58,59.05 36.09,59.05 U26.1
  Top 0.254: R46.2 10.91,51.91 v10.91,52.56 | U29.1 11.04,45.95 C28.1 v12.19,45.85 13.07,45.85 13.32,46.1 R57.2 | v12.12,28.11 12.08,28.07 C26.1 11.32,28.86 11.04,29.14 U27.1 | v32.38,52.45 32.51,52.58 36.08,52.58 39.38,55.88 43.18,55.88 43.43,55.63 43.43,47.37 43.58,47.23 R61.2 44.2,46.35 45.34,45.21 45.34,39.37 46.76,37.95 47.37,37.95 | 47.37,37.95 52.36,37.95 U42.1 | U36.3 52.96,32.52 52.72,32.27 C44.1 R23.2 R47.2 48.13,32.27 47.37,33.03 47.37,37.95 | U28.3 9.65,24.25 10.27,24.88 C45.1 11.8,24.88 12.06,25.15 v12.06,25.27
  Top 0.305: U39.1 31.7,56.15 v31.53,55.98 | v24.37,54.11 22.85,54.11 21.56,52.82 21.56,50.86 19.8,49.1 14.99,49.1 13.32,47.43 R57.2 | C27.1 52.46,39.14 U42.1
  Bottom 0.2: v34.39,57.53 35.91,59.05 v36.58,59.05
  Bottom 0.254: v10.91,52.56 10.91,47.13 v12.19,45.85 13.72,45.85 15.11,47.24 16.26,47.24 17.25,46.25 17.25,39.49 12.12,34.36 v12.12,28.11 12.12,25.33 v12.06,25.27
  Bottom 0.305: v31.53,55.98 31.53,54.24 | 31.53,54.24 24.5,54.24 v24.37,54.11 | 31.53,54.24 31.53,53.84 32.38,52.98 v32.38,52.45
3V3_FEATHER  (via drill 0.25, 0.35)
  Top 0.2: 57.13,82.66 C37.1 56.52,82.68 56.26,82.42 56.26,81.66 55.82,81.22 v55.44,81.22 55.3,81.08 U34.5 | U34.8 55.3,78.83 v55.37,78.77
  Top 0.254: v25.63,82.55 26.42,82.55 26.57,82.7 D7.2
  Top 0.305: MS1.2 v20.32,81.28 | J9.12 J9.10 v51.95,91.56 v51.94,91.57 | v26.67,99.65 26.67,99.97 26.23,100.42 26.23,105.07 26.67,105.51 26.67,112.76 27.57,113.67 R86.2 R87.2
  Bottom 0.2: v55.44,81.22 55.37,81.15 v55.37,78.77
  Bottom 0.305: v55.44,81.22 55.44,86.86 56.03,87.45 56.03,88.35 55.4,88.98 54.53,88.98 v51.94,91.57 48.84,94.67 45.52,94.67 35.81,84.96 35.81,80.39 35.62,80.2 33.85,80.2 31.5,82.55 v25.63,82.55 20.32,82.55 | v20.32,81.28 20.32,82.55 | 20.32,82.55 20.32,83.82 26.67,90.17 v26.67,99.65
3V3_FTDI  (via drill 0.3 pad 0.4)
  Top 0.254: U23.20 7.3,13.14 v7.24,13.08 | U23.10 10.92,9.14 v11.05,9.27 11.11,9.33 U23.11 11.94,10.14 C25.1
  Bottom 0.254: v7.24,13.08 v11.05,9.27
5V_AUX  (via drill 0.25, 0.3, 0.3 pad 0.4, 0.6 pad 1)
  Top 0.2: v36.07,55.88 36.45,55.88 36.96,56.39 36.96,57.4 36.26,58.1 U26.8
  Top 0.254: C1.1 25.91,37.15 v25.91,36.58 | v28.82,45.98 28.82,46.19 29.37,46.74 U33.8 | R58.2 24.26,48.66 24.5,48.9 25.91,48.9 | C36.1 v26.42,48.9 25.91,48.9 | U33.1 25.87,48.85 25.91,48.9
  Top 0.305: Q7.3 v35.56,35.56 35.56,34.42 34.81,33.67 R67.2 | 34.8,31.61 R67.2 | R67.2 34.81,31 34.42,30.61 32.89,30.61 30.57,28.28 R8.2
  Top 0.406: 12.86,41.12 C30.1 13.08,39.62 12.7,39.24 v12.7,38.1 12.7,36.28 R48.2 | 12.86,41.12 U30.3 | C29.1 14.21,41.12 12.86,41.12 | v10.29,60.83 9.45,60 U19.7 | U17.7 54.81,42.36 v54.74,42.29 | F2.2 29.47,101.34 MS1.26
  Top 0.508: U3.1 23.43,28.12 23.95,28.64 U3.16 U3.15 25.07,31.61 C5.+
  Top 0.61: C5.+ 26.99,33.8 C7.1 26.77,35.34 R1.2 16.73,35.34 13.97,38.1 v12.7,38.1 | v45.34,32.64 45.09,32.89 38.99,32.89 36.32,35.56 v35.56,35.56
  Bottom 0.254: v25.91,36.58 25.91,42.18 28.82,45.09 v28.82,45.98 29.65,46.81 | v36.07,55.88 35.43,55.24 35.43,53.87 31.17,49.61 31.17,48.33 29.65,46.81 | v26.42,48.9 27.56,48.9 29.65,46.81
  Bottom 0.61: v10.29,60.83 9.91,61.21 1.57,61.21 | v12.7,38.1 11.43,36.83 8.43,36.83 5.94,34.34 3.31,34.34 1.57,36.07 1.57,61.21 | v25.4,35.31 35.31,35.31 v35.56,35.56 | MS1.26 30.4,100.41 26.11,100.41 22.35,96.65 5.97,96.65 1.57,92.25 1.57,61.21 | v45.34,32.64 47.36,32.64 50.24,35.52 50.24,37.8 v54.74,42.29
  pour Top (rank 3, no thermals): 25.53,38.1 25.53,34.67 25.53,34.42 27.81,34.42 27.81,36.58 28.45,37.21 28.7,37.47 28.7,38.35 25.78,38.35
  pour Top (rank 3, no thermals): 24.13,27.94 23.5,28.57 23.5,33.78 23.88,34.16 24.51,34.16 25.91,34.16 26.54,33.53 26.54,30.61 25.53,29.59 25.53,28.32 25.15,27.94
5V_LP  (via drill 0.25)
  Top 0.2: C4.1 R4.2
  Top 0.254: D8.2 44.72,26.51 U37.1
  Top 0.305: C4.1 46.73,21.52 v45.97,21.52 U6.5 | v45.85,26.8 45.83,26.81 D8.2
  Top 0.406: U1.5 50.16,21.59 49.59,22.16 C4.1 | C15.1 44.97,21.59 U6.5
  Bottom 0.305: v45.97,21.52 45.97,26.67 v45.85,26.8
  pour Top (rank 2, no thermals): 50.42,20.19 50.42,21.97 49.66,22.73 46.61,22.73 46.61,21.34 49.78,21.34 49.91,21.21 49.91,20.19
!LED_EN  (via drill 0.25)
  Top 0.2: v32.43,71.8 32.52,71.72 IC1.40 | v39.32,48.77 39.4,48.77 39.69,49.06 39.69,50.87 40.01,51.18 R18.1 | v38.73,37.34 37.72,38.35 37.72,40.39 37.97,40.64 U45.13
  Bottom 0.2: v32.43,71.8 36.5,71.8 38.84,69.47 38.84,67.65 39.56,66.93 40.28,66.93 41.07,66.14 41.07,62.05 40.59,61.57 40.59,60.7 38.84,58.94 38.84,54.44 39.32,53.96 v39.32,48.77 39.12,48.56 39.12,37.72 v38.73,37.34
!MODE  (via drill 0.25)
  Top 0.2: S6.2 S6.1 25.85,121.08 26.27,120.65 R87.1 26.27,119.14 v26.29,119.13 | J9.32 46.45,92.04 46.84,92.44 48.28,92.44 49.53,93.69 v49.53,96.39
  Bottom 0.2: v49.53,96.39 49.53,98.17 28.57,119.13 v26.29,119.13
!RST  (via drill 0.25)
  Top 0.2: S7.1 S7.2 25.85,112.69 26.27,113.12 R86.1 26.29,113.81 v26.29,115.32 | J9.34 45.95,92.05 46.66,92.76 48.14,92.76 48.77,93.39 v48.77,96.39
  Bottom 0.2: v48.77,96.39 48.04,96.39 47.12,97.32 47.12,98.01 29.81,115.32 v26.29,115.32
ADC_0  (via drill 0.3)
  Top 0.254: U33.4 25.03,46.24 23.37,44.58 18.84,44.58 17.45,45.97 v15.62,45.97
  Bottom 0.305: J1.8 15.58,40.64 15.88,40.93 15.88,44.48 15.62,44.74 v15.62,45.97
ADC_1  (via drill 0.3)
  Top 0.254: v16.26,45.34 17.51,45.34 18.68,44.17 24.74,44.17 25.87,45.3 U33.5
  Bottom 0.305: JP6.1 5.97,38.12 5.97,38.86 6.22,39.12 14.73,39.12 16.38,40.77 16.38,45.21 v16.26,45.34
  Bottom 0.406: J2.1 JP6.1
ADC_2
  Top 0.254: U33.6 31.1,45.74 32.13,44.7 32.13,42.42 34.04,40.51 35.18,40.51 35.65,40.04 35.65,37.05 39.23,33.48 45.6,33.48 46.12,32.96 46.12,31.24 49.42,27.94 J4.5
ADC_3
  Top 0.254: U33.7 31.17,46.24 32.54,44.87 32.54,42.59 34.2,40.92 35.35,40.92 36.06,40.21 36.06,37.22 39.4,33.88 45.77,33.88 46.52,33.13 46.52,31.41 49.58,28.35 58.83,28.35 J4.6
  Bottom 0.254: JP7.1 J4.6
ADC_EXT_ALERT
  Top 0.2: U33.2 27.09,47.24 28.05,48.19 28.25,48.19 28.44,48.38 U41.22
  Top 0.254: U33.2 24.64,47.24 R58.1
ALIVE_LED  (via drill 0.3)
  Top 0.254: IC1.23 36.34,64.28 v36.32,64.26 | v24.84,60.25 22.09,60.25 v21.96,60.12 | v21.59,29.21 21.46,29.34 15.39,29.34 13.35,27.3 13.35,23.62 12.97,23.24 R37.2
  Bottom 0.254: v24.84,60.25 25.2,60.25 25.65,60.71 28.32,60.71 32.13,64.52 36.07,64.52 v36.32,64.26 | v21.96,60.12 21.96,59.91 21.32,59.26 21.32,55.25 21.75,54.82 21.75,45.86 21.37,45.48 21.37,32.68 20.68,32 20.68,30.12 v21.59,29.21
BLUE
  Top 0.2: J9.65 38.2,84.36 37.53,85.03 33.77,85.03 33.62,84.88 33.62,83.66 33.27,83.31 R83.2
BMS_CTR  (via drill 0.3)
  Top 0.2: v20.04,47.9 24.59,52.45 U41.16
  Top 0.254: R14.1 v57.4,14.99 | v16.45,13.78 17.4,12.83 v17.4,12.22
  Bottom 0.2: v20.04,47.9 19.83,47.69 19.83,35.3 13.46,28.94 13.46,20.85 15.24,19.07 15.24,15.26 15.49,15.01 15.59,15.01 15.9,14.7 15.9,14.33 v16.45,13.78
  Bottom 0.254: v57.4,14.99 40.51,14.99 40.02,14.5 40.02,13.94 39.87,13.79 39.87,5.09 40.54,4.42 40.54,2.95 40.23,2.64 25.05,2.64 23.8,3.89 23.8,6.68 19.32,11.16 18.16,11.16 17.4,11.92 v17.4,12.22
BSOM_VUSB  (via drill 0.35)
  Top 0.305: USB2.1 61.7,102.84 61.83,102.71 61.83,102.3 62.09,102.04 62.09,100.57 v61.34,99.82 | v27.43,105.66 F2.1 | J9.16 50.45,92.99 54.05,96.6 56.37,96.6 57.15,97.37 v57.15,99.82
  Bottom 0.305: v61.34,99.82 v57.15,99.82 57.15,96.52 56.36,95.73 35.93,95.73 34.29,97.37 34.29,98.81 v27.43,105.66
BUS_LOGIC_EN_PRIME  (via drill 0.25, 0.3)
  Top 0.2: U29.8 9.54,51.28 R46.1 v8.38,51.56 | U41.21 27.94,49.79 27.75,49.6 24.33,49.6 22.42,47.69 22.42,45.82 21.56,44.96 19.3,44.96 17.65,46.61 v16.08,46.61 | U27.8 9.16,32.64 v9.91,32.64 | v8.89,25.4 9.27,25.4 9.65,25.78 U28.6
  Bottom 0.2: v8.38,51.56 8.38,49.78 10.53,47.64 10.53,46.76 11.97,45.32 13.72,45.32 15.02,46.61 v16.08,46.61 16.87,45.82 16.87,39.64 9.91,32.68 v9.91,32.64 8.89,31.62 v8.89,25.4
BUS_LOGIC_EN_SEC  (via drill 0.25)
  Top 0.2: U41.24 29.44,50.06 29.84,49.66 31.37,49.66 32.64,48.39 32.64,45.31 32.92,45.03 32.92,42.74 34.36,41.3 35.5,41.3 36.44,40.36 36.44,37.38 39.56,34.26 45.93,34.26 46.9,33.29 46.9,31.57 48.57,29.9 | U36.6 52.96,29.34 52.83,29.21 49.26,29.21 48.57,29.9 | R47.1 48.9,30.23 48.57,29.9
  Top 0.254: v54.54,34.6 U42.8 | v52.96,31.11 U36.6
  Bottom 0.254: v54.54,34.6 52.96,33.02 v52.96,31.11
C0  (via drill 0.25)
  Top 0.152: U16.2 30.69,17.91 31.02,17.57 31.44,17.57 31.97,18.1 U40.1 32.5,18.86 v31.96,19.39
  Top 0.2: v35.03,63.37 IC1.21
  Bottom 0.152: v31.96,19.39 31.94,19.41
  Bottom 0.2: v31.96,19.39 31.96,20.15 32.34,20.53 36.84,20.53 37.34,21.03 37.34,52.34 38.35,53.35 38.35,53.85 38.1,54.1 38.1,59.84 39.11,60.84 39.11,62.69 38.56,63.23 36.43,63.23 36.02,62.82 35.58,62.82 v35.03,63.37
C1  (via drill 0.25)
  Top 0.152: v33.14,19.05 v33.15,19.05 U40.2 | v34.54,19.31 34.2,19.65 34.2,20.5 33.73,20.97 32.63,20.97 31.76,21.84 31.37,21.84 31.04,21.51 U16.6
  Top 0.2: v35.81,63.33 35.52,63.62 IC1.22
  Bottom 0.2: v33.14,19.05 33.4,19.31 v34.54,19.31 36.79,19.31 37.69,20.21 37.69,52.19 38.71,53.21 38.71,54 38.45,54.25 38.45,59.69 39.5,60.73 39.5,62.87 38.78,63.58 36.07,63.58 v35.81,63.33
CC1
  Top 0.2: R85.2 1.53,2.52 1.72,2.71 3.47,2.71 5.1,4.34 J10.A5
CC2
  Top 0.2: R84.2 11.17,2.52 10.98,2.71 9.61,2.71 8.1,4.22 J10.B5
CS_EXT  (via drill 0.25)
  Top 0.2: IC1.37 34.02,72.79 v33.96,72.85 | v12.95,29.72 12.81,29.86 U27.2
  Bottom 0.2: v12.95,29.72 13.2,29.72 19.1,35.62 19.1,51.25 19.61,51.76 19.61,58.51 21.61,60.51 21.61,69.6 22.01,70 28.83,70 31.88,73.05 33.76,73.05 v33.96,72.85
CS_OUT
  Top 0.254: J2.6 5.97,27.56 5.97,29.21 6.6,29.84 8.16,29.84 U27.13
CSA_!ALERT  (via drill 0.25)
  Top 0.2: U41.4 30.24,52.86 30.73,52.86 30.9,52.68 31.47,52.68 31.86,52.3 31.86,52.23 32.17,51.92 32.62,51.92 32.9,52.2 36.45,52.2 v37.85,53.59 | v36.32,28.7 36.32,28.19 35.77,27.64 U32.1
  Bottom 0.2: v37.85,53.59 36.96,52.7 36.96,29.34 v36.32,28.7
D+
  Top 0.2: J10.A6 6.1,7.24 | R35.2 4.95,9.78 5.08,9.65 5.08,7.87 5.72,7.24 6.1,7.24 | 6.1,7.24 6.74,7.24 7.1,6.87 J10.B6
  Top 0.254: R35.2 C24.2
D-
  Top 0.2: R34.2 4.43,8.02 5.6,6.85 J10.B7 5.6,5.45 5.71,5.33 6.48,5.33 6.6,5.46 J10.A7
  Top 0.254: C23.2 R34.2
DAC_OUT
  Top 0.406: U30.1 8,41.12 | 8,41.12 7.01,41.12 4.95,43.18 J1.7 | C33.1 8,41.12
DTR
  Top 0.2: C39.1 8.64,14.08 9.11,13.61 U23.18
EN_BUS_PRIME  (via drill 0.25, 0.25 pad 0.4)
  Top 0.152: U15.6 15.67,58.1 15.22,58.55 R25.1 14.48,59.18 v14.35,59.05 | U15.1 v14.43,56.81 v14.43,56.82
  Top 0.2: IC1.26 36.9,66.56 37.06,66.4 39.69,66.4 40.51,67.23 40.51,67.99 v40.56,68.04
  Bottom 0.152: v14.43,56.82 14.43,57.38 13.99,57.81 13.99,58.32 14.35,58.67 v14.35,59.05
  Bottom 0.2: v40.56,68.04 40.56,68.9 36.5,72.96 35.37,72.96 34.52,73.81 31.61,73.81 31.23,73.43 21.74,73.43 15.67,67.36 15.67,60.83 14.35,59.52 v14.35,59.05
EN_BUS_SEC  (via drill 0.25)
  Top 0.152: v48.77,48.26 48.72,48.21 U14.1 | R24.1 47.23,46.74 47.45,46.96 U14.6
  Top 0.2: v46.23,46.1 46.59,46.1 46.72,46.23 R24.1 | v43.31,61.98 43.31,62.38 41.01,64.67 38.42,64.67 37.04,66.05 IC1.25
  Bottom 0.2: v43.31,61.98 43.31,61.72 43.43,61.6 43.43,61.18 43.31,61.06 43.31,50.55 45.59,48.26 47.12,48.26 | v46.23,46.1 47.12,46.99 47.12,48.26 | 47.12,48.26 v48.77,48.26
FAULT_PRIME  (via drill 0.25, 0.3)
  Top 0.2: U20.2 12.12,56.57 v12.06,56.52 | v12.16,57.85 12.16,59.78 12.38,60 U19.2 | R57.1 15.26,46.74 16.18,47.66 v17.1,47.66 19.32,45.43 21.54,45.43 22.07,45.97 22.07,47.85 24.23,50.01 27.26,50.01 27.43,50.18 U41.20
  Bottom 0.2: v17.1,47.66 17.1,51.25 15.68,52.66 15.68,53.41 12.57,56.52 v12.06,56.52 12.06,57.75 v12.16,57.85
FAULT_SEC  (via drill 0.25, 0.3)
  Top 0.2: U41.6 31.06,53.95 32.02,52.99 35.96,52.99 39.22,56.26 v48.9,56.26 | R61.1 44.2,49.53 44.45,49.78 v45.47,49.78
  Top 0.254: v52.7,45.85 52.52,45.66 U18.2 50.74,45.66 50.54,45.46 50.54,43.82 50.87,43.49 52.19,43.49 52.45,43.23 52.45,42.67 52.14,42.36 U17.2
  Bottom 0.2: v52.7,45.85 52.52,46.03 52.52,48.01 50.48,50.04 48.9,50.04 | 48.9,50.04 45.72,50.04 v45.47,49.78 | v48.9,56.26 48.96,56.2 48.96,50.1 48.9,50.04
FEATHER_BAT  (via drill 0.35)
  Top 0.305: J9.8 J9.6 J9.4 | J9.4 J9.2 | MS1.28 25.99,97.79 | J9.4 53.45,92.6 v53.34,92.71
  Top 0.508: U10.6 25.99,97.79 U10.5
  Bottom 0.406: MS1.28 30.48,95.25 50.8,95.25 v53.34,92.71
  pour Top (no thermals): 29.08,98.55 28.7,98.93 25.53,98.93 25.27,98.68 25.27,96.9 25.53,96.65 28.7,96.65 29.08,97.03
FEATHER_CTS  (via drill 0.25)
  Top 0.2: IC1.31 36.92,69.06 37.68,69.82 40.05,69.82 44.45,74.22 v44.45,81.28 | J9.40 44.45,92.46 45.08,93.09 48.01,93.09 48.26,93.34 v48.26,93.73 MS1.20
  Bottom 0.2: v48.26,93.73 47.82,94.17 47.18,94.17 44.45,91.44 v44.45,81.28
FEATHER_EN  (via drill 0.25, 0.3)
  Top 0.2: v37.72,73.66 37.46,73.92 37.46,75.01 36.21,76.27 24.57,76.27 24.13,76.71 24.13,78.74 22.72,80.15 R19.1 | U41.7 30.86,54.66 32.17,53.35 35.81,53.35 39.11,56.64 40.99,56.64 v43.94,59.59
  Top 0.305: R19.1 22.42,82.09 Q3.1
  Bottom 0.2: v37.72,73.66 38.1,73.66 43.94,67.82 43.94,59.85 v43.94,59.59
FEATHER_GPIO
  Top 0.2: IC1.32 36.92,69.56 37.54,70.17 39.9,70.17 40.64,70.91 MS1.10 40.64,78.61 43.7,81.67 J9.43
FEATHER_RTS  (via drill 0.25)
  Top 0.2: IC1.30 36.94,68.56 37.85,69.47 40.2,69.47 46.99,76.27 v46.99,80.52 | J9.42 43.95,92.8 44.81,93.66 v47.56,93.66 47.56,96.87 47.12,97.32 47.12,98.26 47.79,98.93 48.73,98.93 49.87,97.79 MS1.19
  Bottom 0.2: v46.99,80.52 46.99,93.09 v47.56,93.66
GLOBAL_INT  (via drill 0.25)
  Top 0.2: IC1.33 36.34,70.84 v36.32,70.87 | v23.35,57.15 25.15,55.36 25.15,53.72 25.41,53.45 U41.14
  Bottom 0.2: v36.32,70.87 35.43,70.87 30.27,65.7 27.49,65.7 23.35,61.57 v23.35,57.15
GND  (via drill 0.25, 0.3, 0.35, 0.6 pad 1)
  Top 0.152: U15.4 16.02,56.24 16.36,55.91 17.22,55.91 | 17.22,55.91 17.88,55.91 17.91,55.88 | U12.B1 17.22,55.91 | U11.B1 45.39,48.08 | v45.97,43.94 45.97,45.21 45.39,45.79 45.39,48.08 | 46.29,49.25 46.8,49.25 47.1,48.95 U14.4 | 46.29,49.25 45.82,49.25 45.39,48.82 45.39,48.08 | S1.3 46.26,49.28 46.29,49.25 | U16.4 31.78,18.71 v31.92,18.58
  Top 0.2: 9.4,52.7 9.4,52.58 9.95,52.02 9.95,51.01 10.47,50.49 U29.7 | v35.41,60.17 36.06,60.82 36.31,60.82 36.46,60.97 36.46,61.6 36.31,61.75 36.01,61.75 U24.2 | U26.4 34.83,59.38 34.29,59.92 v33.48,59.92 | R27.2 v45.97,43.94 | U31.7 54.03,71.43 53.72,71.12 52.96,71.12 52.7,71.37 52.7,72.52 53.38,73.19 U31.1 | U7.3 U7.2 | v28.96,38.35 v28.96,37.34 | U19.3 17.2,60.65 17.91,59.94 17.91,55.88 17.91,54.76 S2.3 | U13.B1 34.24,32.97 33.51,32.24 R67.1 | v34.42,18.16 34.36,18.1 U40.3 | U45.1 U45.2 41.67,39.99 | U45.19 41.67,39.99 | 41.67,39.99 U45.EP | U45.14 40.37,39.99 U45.EP | U45.8 U45.EP | 48.64,64.02 C46.2 47.36,64.02 47.13,64.25 U44.1 | 48.64,64.02 49.37,64.02 C57.2 49.39,63.98 | C38.2 49.39,63.98 | U43.8 U43.9 50.15,63.88 50.06,63.98 49.39,63.98 | U38.9 U38.10 U38.11 | U38.11 U38.12 | C48.2 47.23,68.33 U38.11 | U38.11 49.28,68.33 | U38.13 U38.14 49.28,68.33 | 49.28,68.33 U38.EP | U38.16 50.28,67.83 U38.EP | U38.EP 50.28,69.33 U38.4 51.92,69.33 C47.2 | v51.98,62.78 51.96,62.81 U43.1 | v48.51,65.02 48.64,64.9 48.64,64.02 | U34.4 56.61,80.61 56.77,80.77 56.77,81.66 57.02,81.92 58.29,81.92 58.44,82.06 C37.2
  Top 0.254: U23.6 8.11,10.14 U23.EP | U23.3 U23.EP | U23.EP U23.13 12.06,11.14 12.14,11.14 C25.2 | R10.2 56.07,10.54 U5.4 | C41.1 27.83,67.56 | 27.83,67.56 IC1.6 | C40.1 27.57,67.56 27.83,67.56 | U33.3 27.3,46.74 v27.69,47.12 28.32,47.75 28.7,47.75 29.1,48.15 C36.2 | U7.2 32,14.48 31.65,14.83 30.5,14.83 v29.84,14.17 | IC1.18 33.52,67.06 IC1.TH | 4.76,18.73 7.49,21.46 v7.49,22.35 7.85,22.71 8.99,22.71 9.15,22.86 U28.2 9.15,24.52 10.29,25.65 10.65,25.65 C45.2 | v57.15,31.62 56.68,31.62 R50.1 | C32.2 57.16,70.37 59.69,72.9 v59.69,74.96 | U31.1 53.38,74.59 54.36,75.56 59.09,75.56 v59.69,74.96 | v59.69,74.96 60.96,74.96 | BT1.GND 61.59,60.33 61.59,66.8 61.47,66.93 C34.2 60.98,69 61.59,69.61 RTC1.5 61.59,74.68 61.31,74.96 60.96,74.96 | S3.2 S3.1 S4.2 | S4.2 S4.1 | S4.2 3,72.35 2.2,73.15 2.2,77.22 | 2.2,77.22 2.2,79.46 1.61,80.05 SD1.MT2 | ISP1.6 2.2,77.22 | U25.4 14.09,77.46 v13.59,77.95 | R17.2 28.79,1.4 27.3,1.4 26.92,1.78 26.92,2.03 | 26.92,2.03 26.92,3.54 U4.6 26.27,4.74 25.68,5.33 25.41,5.33 U4.EP | C10.2 26.92,2.03 | C28.2 10.29,46.5 10.29,48.39 | 10.29,48.39 U29.EP | U29.7 11.04,49.14 10.29,48.39 | R26.1 v45.97,40.51 | R3.1 29.34,27.18 29.77,27.61 29.77,28.68 29.59,28.87 29.59,29.59 | R28.1 8,62.61 v7.75,62.36 | R29.2 13.63,62.61 v13.89,62.36 | v5.71,81.92 4.76,82.87 SD1.MT2 | SD1.MT2 SD1.MT1 | C36.2 30.35,48.9 v30.61,49.15 | 3.81,60.59 R65.1 | R66.1 61.45,48.01 60.96,47.51 J3.1 | U41.23 28.94,49.8 29.08,49.66 29.08,48.91 C36.2 | C15.2 43.67,22.86 44.07,23.26 44.07,24.51 | 44.07,24.51 U37.2 | C4.2 45.79,24.06 45.34,24.51 44.07,24.51 | C27.2 53.21,38.59 U42.EP 53.05,36.32 52.46,35.74 U42.7 53.02,34.6 53.46,34.16 U36.2 53.46,32.38 52.05,30.97 C44.2 R23.1
  Top 0.254: C26.2 9.91,28.18 v9.91,29.08 U27.EP 10.66,31.61 U27.7 | v36.45,43.18 37.97,43.18 38.33,42.82 38.84,42.82 U45.EP | U38.12 48.13,67.78 v48.13,66.8 | U35.4 U35.3 | U35.3 U35.2 U35.1 | 60.96,77.22 59.56,77.22 58.9,76.55 57.53,76.55 57.28,76.8 57.28,77.89 57.88,78.49 U35.7 | 60.96,74.96 60.96,77.22 | R85.1 0.89,6.73 1.38,7.22 1.38,7.75 | 1.38,7.75 C23.1 | v3.17,7.73 1.4,7.73 1.38,7.75 | 60.96,77.22 61.85,78.11 61.85,79.76 | 61.85,79.76 61.85,82.44 C50.2 61.61,83.3 61.47,83.44 58.55,83.44 58.44,83.33 C37.2 | U35.3 61.85,79.76 | S6.4 S6.3 28.62,121.75 28.96,121.41 28.96,116.84 | S7.3 S7.4 28.62,112.44 28.96,112.78 28.96,116.84 | 28.96,116.84 44.93,116.84
  Top 0.305: C24.1 C23.1 | 38.9,22.86 C18.2 39.75,22.14 39.75,20.57 | U9.2 39.75,20.57 | 39.75,20.57 U6.2 43.56,20.57 | C17.2 39.75,19.83 39.75,20.57 | C16.2 43.56,19.07 43.56,20.57 | IC1.TH IC1.28 C42.2 | IC1.6 IC1.TH | IC1.TH IC1.39 33.02,72.01 32.51,72.52 32.51,74.51 31.67,75.35 25.03,75.35 24.36,74.68 v19.56,74.68 | C8.2 30.54,44.26 29.59,45.21 v28.07,45.21 | v33.37,62.54 33.37,62.77 33.6,63.01 33.6,63.49 33.52,63.57 IC1.18 | SD1.6 6.53,92.13 7.24,92.84 7.24,94.74 | 57.14,31.64 v57.15,31.62 | 25.4,27.67 U3.PAD@4 | C2.2 24.43,23.22 U3.5 | U19.3 12.01,60.65 10.92,59.56 v10.92,58.8 10.92,58.29 11.99,57.22 U20.3 | SD1.MT1 6.21,95.77 7.24,94.74 | 7.24,94.74 10.21,94.74 SD1.CD2 13.12,95.89 13.72,96.5 15.94,96.5 16.08,96.36 16.08,95.45 SD1.MT4 16.21,91.74 17.4,90.55 17.4,87.61 SD1.MT3 | C15.2 43.56,22.62 43.56,20.57 | 46.8,24.64 C4.2 | v32.26,55.5 U39.2 U39.5 | U41.23 28.94,51.95 U41.EP 27.44,53.45 U41.11 | R67.1 31.07,31.62 C5.- | 12.06,11.14 13.67,11.14 R63.1 14.99,11.19 | v33.02,22.86 33.02,23.62 U32.EP 34.47,25.73 U32.3 34.47,28.5 C35.2 | R51.1 31.11,24.26 v30.73,23.88 | U10.2 24.13,97.28 24.38,97.03 24.38,94.61 | 24.38,94.61 24.38,92.58 24.77,92.2 31.5,92.2 32.26,91.44 32.26,90.3 | 24.38,94.61 24.4,94.63 Q4.2 R54.1 | JP8.2 32.26,88.52 | 32.26,90.3 32.22,90.34 26.46,90.34 26.29,90.16 26.29,89.02 25.78,88.52 24.64,88.52 24.38,88.27 U8.2 | 32.26,88.52 32.26,87.25 31.5,86.49 26.16,86.49 25.02,85.35 25.02,82.62 25.02,82.17 25.65,81.53 | 32.26,88.52 32.26,90.3 | 14.99,11.19 16.47,11.19 Q8.2 | v14.99,12.95 14.99,11.19 | J9.21 49.2,81.49 49.4,81.28 50.67,81.28 | 50.67,81.28 52.07,81.28 52.2,81.41 J9.9 J9.7 J9.5
  Top 0.305: 50.67,81.28 50.7,81.3 J9.15 50.7,84.1 53.81,87.21 53.81,88.37 57.81,92.36 57.81,105.41 | J9.39 44.7,82.63 44.7,83.57 44.56,83.7 42.21,83.7 42.2,83.69 | J9.76 34.6,81.73 34.92,81.41 42.04,81.41 42.2,81.57 J9.49 42.2,83.69 | J9.56 40.45,87.44 42.2,85.69 42.2,83.69 | J9.77 54.52,82.62 J9.1 J9.3 J9.5 | J9.5 53.2,83.93 v53.21,83.95 | J9.GND 44.93,116.84 44.93,115.66 48.83,111.76 55.88,111.76 57.81,109.83 57.81,105.41 | USB2.5 57.84,105.44 57.81,105.41